# EAGLE design extrudernode (EAGLE 6.4)
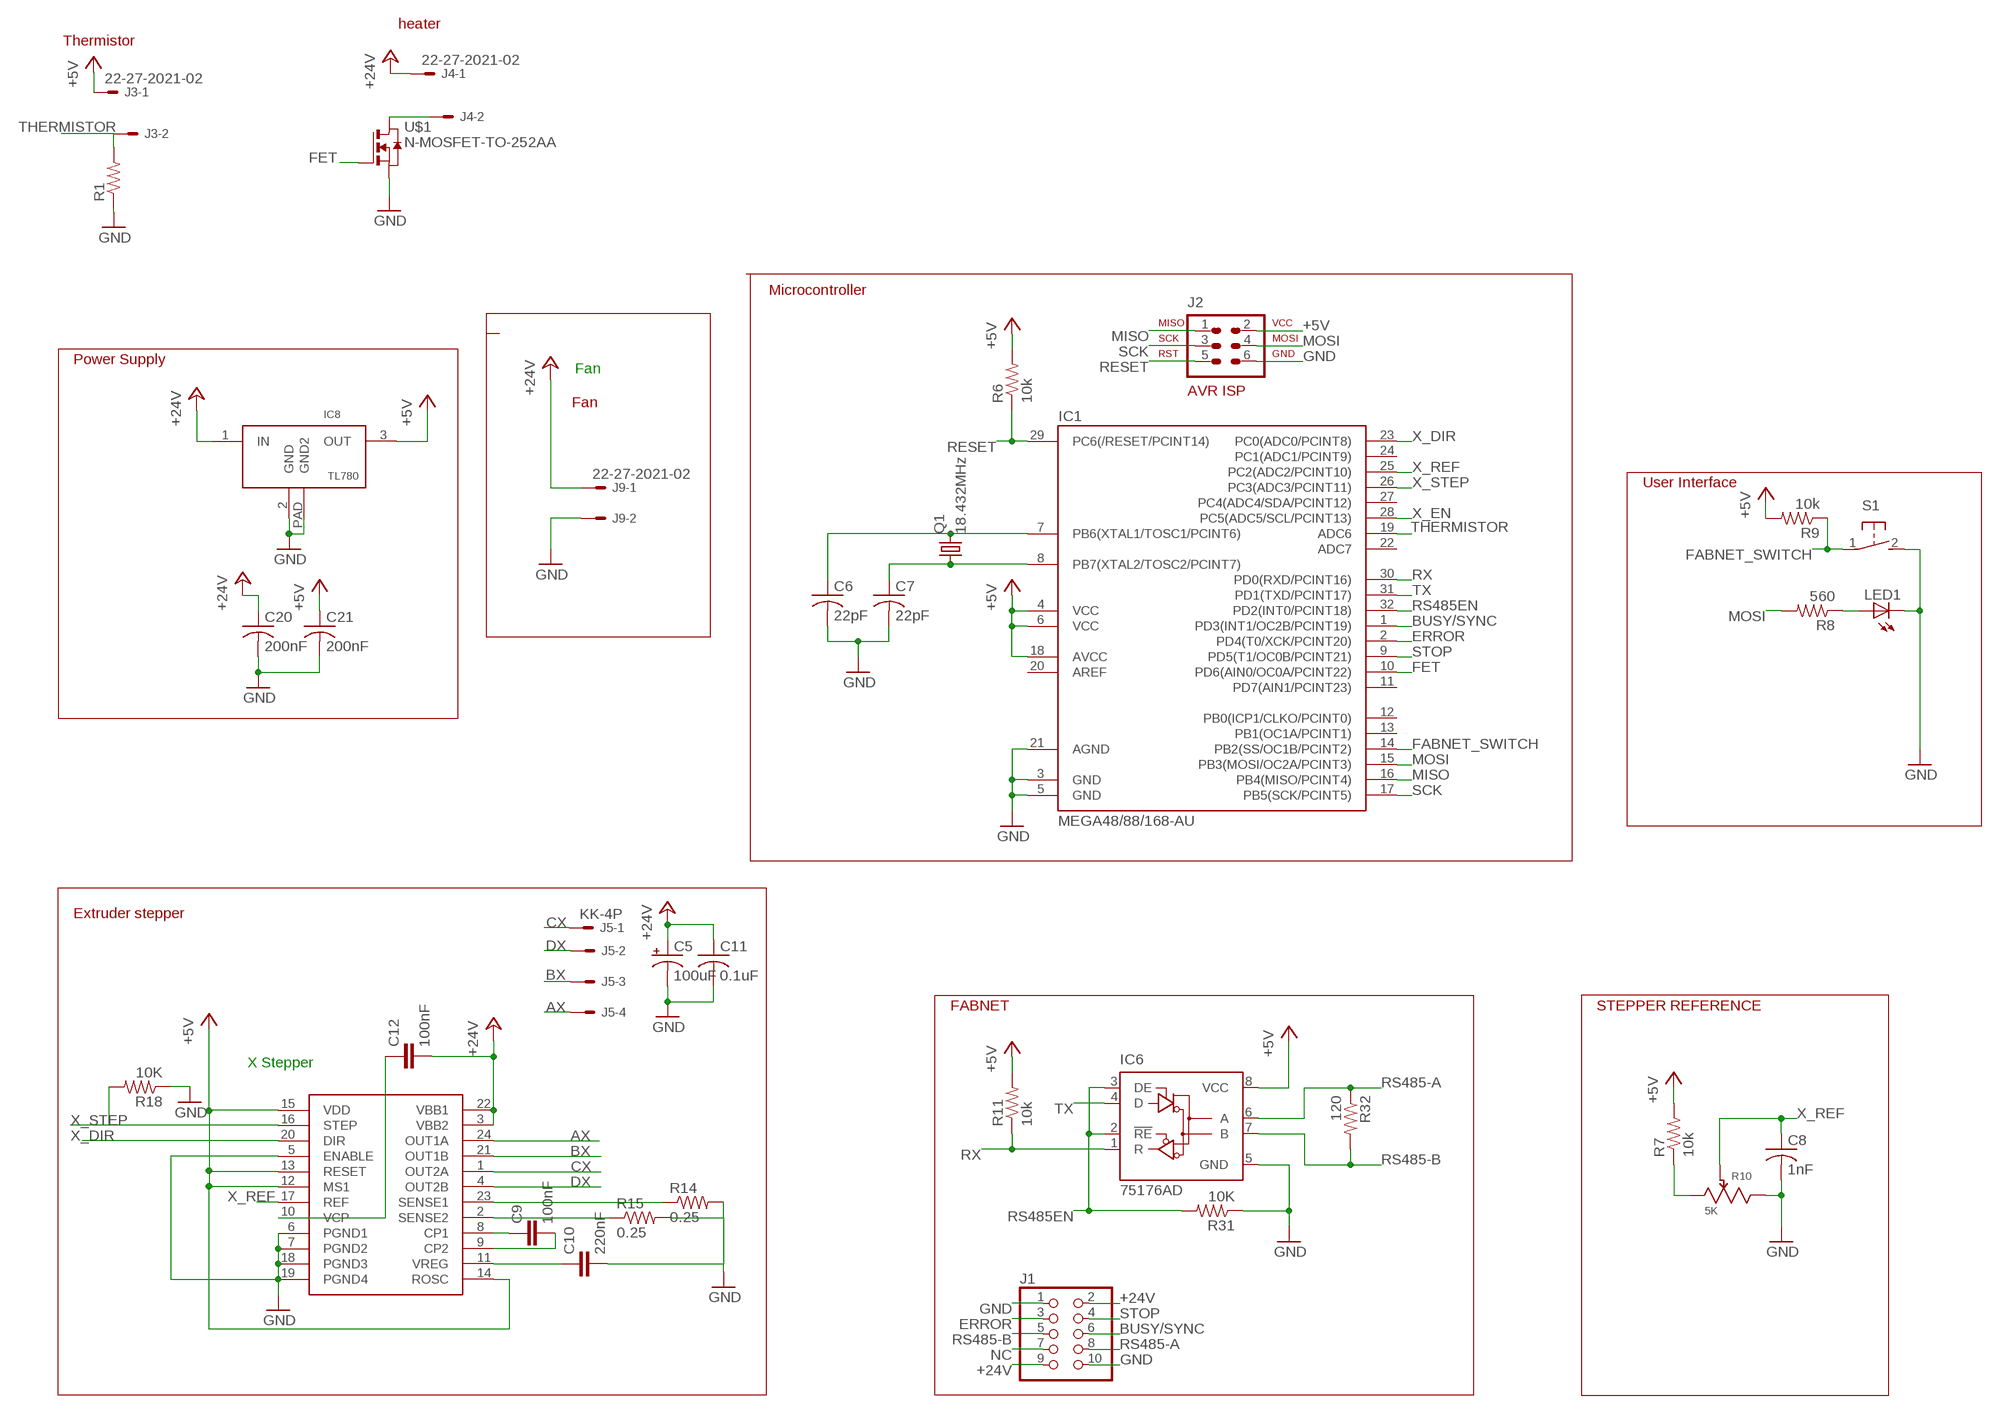
[diagram p0: schematic, sheet 1]

## Parts
C5  100uF  CPOL-USD  [PANASONIC_D]
C6  22pF  C-USC0805  [C0805@1]
C7  22pF  C-USC0805  [C0805@1]
C8  1nF  C-USC0805  [C0805@1]
C9  100nF  C-EUC1206  [C1206]
C10  220nF  C-EUC1206  [C1206]
C11  0.1uF  C-USC0805  [C0805@1]
C12  100nF  C-EUC1206  [C1206]
C20  200nF  C-USC0805  [C0805@1]
C21  200nF  C-USC0805  [C0805@1]
DRIVER3  A3982  A3982SOIC24  [SO24W]
IC1  MEGA48/88/168-AU  [TQFP32-08]
IC6  75176AD  [D_R-PDSO-G8]
IC8  TL780_VREG  [D2PAK-3]
J1  PINHD-2X5  [2X05]
J2  AVR-ISP-6VERT  [AVR-ISP-6]
J3  22-27-2021-02  [6410-02]
J4  22-27-2021-02  [6410-02]
J5  KK-4P  22-05-7048-04  [7395-04]
J9  22-27-2021-02  [6410-02]
LED1  LEDCHIPLED_0603  [CHIPLED_0603]
Q1  18.432MHz  CRYSTALHC49UP  [HC49UP]
R1  RESISTOR1206  [1206]
R6  10k  R-US_R0805  [R0805]
R7  10k  R-US_R0805  [R0805]
R8  560  R-US_R0805  [R0805]
R9  10k  R-US_R0805  [R0805]
R10  5K  BOURN_POT  [BOURN_TRIM]
R11  10k  R-US_R0805  [R0805]
R14  0.25  R-US_R2512  [R2512]
R15  0.25  R-US_R2512  [R2512]
R18  10K  R-US_R1206  [R1206]
R31  10K  R-US_R0805  [R0805]
R32  120  R-US_R0805  [R0805]
S1  31-XX  [B3F-31XX]
U$1  N-MOSFET-TO-252AA  [TO-252AA]

## Nets
+5V: C21.1 DRIVER3.12(MS1) DRIVER3.13(RESET) DRIVER3.14(ROSC) DRIVER3.15(VDD) IC1.4(VCC) IC1.6(VCC) IC1.18(AVCC) IC6.8(VCC) IC8.3(OUT) J2.2 J3.1 R6.2 R7.2 R9.2 R11.2
+24V: C5.+ C11.1 C12.2 C20.1 DRIVER3.3(VBB2) DRIVER3.22(VBB1) IC8.1(IN) J1.2 J1.9 J4.1 J9.1
AX [power]: DRIVER3.24(OUT1A) J5.4
BUSY/SYNC: IC1.1(PD3(INT1/OC2B/PCINT19)) J1.6
BX [power]: DRIVER3.21(OUT1B) J5.3
CX [power]: DRIVER3.1(OUT2A) J5.1
DX [power]: DRIVER3.4(OUT2B) J5.2
ERROR: IC1.2(PD4(T0/XCK/PCINT20)) J1.3
FABNET_SWITCH: IC1.14(PB2(SS/OC1B/PCINT2)) R9.1 S1.1(P)
FET: IC1.10(PD6(AIN0/OC0A/PCINT22)) U$1.GATE(G)
GND: C5.- C6.2 C7.2 C8.2 C10.2 C11.2 C20.2 C21.2 DRIVER3.5(ENABLE) DRIVER3.6(PGND1) DRIVER3.7(PGND2) DRIVER3.18(PGND3) DRIVER3.19(PGND4) IC1.3(GND) IC1.5(GND) IC1.21(AGND) IC6.5(GND) IC8.2(GND) IC8.PAD(GND2) J1.1 J1.10 J2.6 J9.2 LED1.C R1.1 R10.3 R14.2 R15.2 R18.1 R31.1 S1.2(S) U$1.SOURCE(S)
MISO: IC1.16(PB4(MISO/PCINT4)) J2.1
MOSI: IC1.15(PB3(MOSI/OC2A/PCINT3)) J2.4 R8.2
N2354: R7.1 R10.1
N$1: C6.1 IC1.7(PB6(XTAL1/TOSC1/PCINT6)) Q1.2
N$2: C7.1 IC1.8(PB7(XTAL2/TOSC2/PCINT7)) Q1.1
N$5: LED1.A R8.1
N$8: J4.2 U$1.DRAIN(D)
N$23 [power]: DRIVER3.23(SENSE1) R14.1
N$24 [power]: DRIVER3.2(SENSE2) R15.1
N$25: C9.1 DRIVER3.8(CP1)
N$26: C9.2 DRIVER3.9(CP2)
N$27: C10.1 DRIVER3.11(VREG)
N$28: C12.1 DRIVER3.10(VCP)
NC: J1.7
RESET: IC1.29(PC6(/RESET/PCINT14)) J2.5 R6.1
RS485-A: IC6.6(A) J1.8 R32.1
RS485-B: IC6.7(B) J1.5 R32.2
RS485EN: IC1.32(PD2(INT0/PCINT18)) IC6.2(!RE) IC6.3(DE) R31.2
RX: IC1.30(PD0(RXD/PCINT16)) IC6.1(R) R11.1
SCK: IC1.17(PB5(SCK/PCINT5)) J2.3
STOP: IC1.9(PD5(T1/OC0B/PCINT21)) J1.4
THERMISTOR: IC1.19(ADC6) J3.2 R1.2
TX: IC1.31(PD1(TXD/PCINT17)) IC6.4(D)
X_DIR: DRIVER3.20(DIR) IC1.23(PC0(ADC0/PCINT8))
X_EN: IC1.28(PC5(ADC5/SCL/PCINT13))
X_REF: C8.1 DRIVER3.17(REF) IC1.25(PC2(ADC2/PCINT10)) R10.2
X_STEP: DRIVER3.16(STEP) IC1.26(PC3(ADC3/PCINT11)) R18.2
Unconnected: IC1.11(PD7(AIN1/PCINT23)) IC1.12(PB0(ICP1/CLKO/PCINT0)) IC1.13(PB1(OC1A/PCINT1)) IC1.20(AREF) IC1.22(ADC7) IC1.24(PC1(ADC1/PCINT9)) IC1.27(PC4(ADC4/SDA/PCINT12))

## Notes on the sheet
- heater
- Thermistor
- Microcontroller
- Power Supply
- Fan
- Fan
- User Interface
- Extruder stepper
- FABNET | STEPPER REFERENCE
- X Stepper

## Library data of the parts
C5 = rcl:CPOL-US: POLARIZED CAPACITOR, American symbol
C6-C8 C11 C20 C21 = rcl:C-US: CAPACITOR, American symbol
C9 C10 C12 = rcl:C-EU: CAPACITOR, European symbol
DRIVER3 = reprap:A3982
IC1 = avr-7:MEGA48/88/168
IC6 = 751xx:75176A: DIFFERENTIAL BUS TRANSCEIVER Source: http://focus.ti.com/lit/ds/symlink/sn75176a.pdf
IC8 = MtMM:TL780_VREG
J1 = pinhead:PINHD-2X5: PIN HEADER
J2 = avr-7:AVR-ISP-6: AVR ISP-6 Serial Programming Header
J3 J4 J9 = con-molex:22-?-02: CONNECTOR wire to board 2.54 mm (.1 inch) pitch header; OC_FARNELL: unknown; OC_NEWARK: unknown
J5 = con-molex:22-?-04: CONNECTOR wire to board 2.54 mm (.1 inch) pitch header; OC_FARNELL: unknown; OC_NEWARK: unknown
LED1 = led:LED: LED OSRAM: - CHIPLED LG R971, LG N971, LY N971, LG Q971, LY Q971, LO R971, LY R971 LH N974, LH R974 LS Q976, LO Q976, LY Q976 LO Q996 - Hyper CHIPLED LW Q18S LB Q993, LB Q99A, LB R99A - SideLED LS A670, LO A670, LY A670, LG A670, LP A670 LB A673, LV A673, LT A673, LW A673 LH A674 LY A675 LS A676, LA A676, LO A676, LY A676, LW A676 LS A679, LY A679, LG A679 - Hyper Micro SIDELED® LS Y876, LA Y876, LO Y876, LY Y876 LT Y87S - SmartLED LW L88C, LW L88S LB L89C, LB L89S, LG L890 LS L89K, LO L89K, LY L89K LS L896, LA L896, LO L896, LY L896 - TOPLED LS T670, LO T670, LY T670, LG T670, LP T670 LSG T670, LSP T670, LSY T670, LOP T670, LYG T670 LG T671, LOG T671, LSG T671 LB T673, LV T673, LT T673, LW T673 LH T674 LS T676, LA T676, LO T676, LY T676, LB T676, LH T676, LSB T676, LW T676 LB T67C, LV T67C, LT T67C, LS T67K, LO T67K, LY T67K, LW E67C LS E67B, LA E67B, LO E67B, LY E67B, LB E67C, LV E67C, LT E67C LW T67C LS T679, LY T679, LG T679 LS T770, LO T770, LY T770, LG T770, LP T770 LB T773, LV T773, LT T773, LW T773 LH T774 LS E675, LA E675, LY E675, LS T675 LS T776, LA T776, LO T776, LY T776, LB T776 LHGB T686 LT T68C, LB T68C - Hyper Mini TOPLED® LB M676 - Mini TOPLED Santana® LG M470 LS M47K, LO M47K, LY M47K Source: http://www.osram.convergy.de LUXEON: - LUMILED® LXK2-PW12-R00, LXK2-PW12-S00, LXK2-PW14-U00, LXK2-PW14-V00 LXK2-PM12-R00, LXK2-PM12-S00, LXK2-PM14-U00 LXK2-PE12-Q00, LXK2-PE12-R00, LXK2-PE12-S00, LXK2-PE14-T00, LXK2-PE14-U00 LXK2-PB12-K00, LXK2-PB12-L00, LXK2-PB12-M00, LXK2-PB14-N00, LXK2-PB14-P00, LXK2-PB14-Q00 LXK2-PR12-L00, LXK2-PR12-M00, LXK2-PR14-Q00, LXK2-PR14-R00 LXK2-PD12-Q00, LXK2-PD12-R00, LXK2-PD12-S00 LXK2-PH12-R00, LXK2-PH12-S00 LXK2-PL12-P00, LXK2-PL12-Q00, LXK2-PL12-R00 Source: www.luxeon.com KINGBRIGHT: KA-3528ASYC Source: www.kingbright.com
Q1 = crystal:CRYSTAL: CRYSTAL; OC_FARNELL: unknown; OC_NEWARK: unknown
R1 = ng:RESISTOR
R6-R9 R11 R14 R15 R31 R32 = rcl:R-US_: RESISTOR, American symbol
R10 = unitoffab:BOURN_POT
R18 = resistor:R-US_: RESISTOR, American symbol
S1 = switch-omron:31-XX: OMRON SWITCH; MPN: B3F-3100; OC_FARNELL: 959704; OC_NEWARK: 36M3582
U$1 = nmosfet:N-MOSFET-TO-252AA

## Net classes
1 power: width 0.305 mm, clearance 0.203 mm

## Board
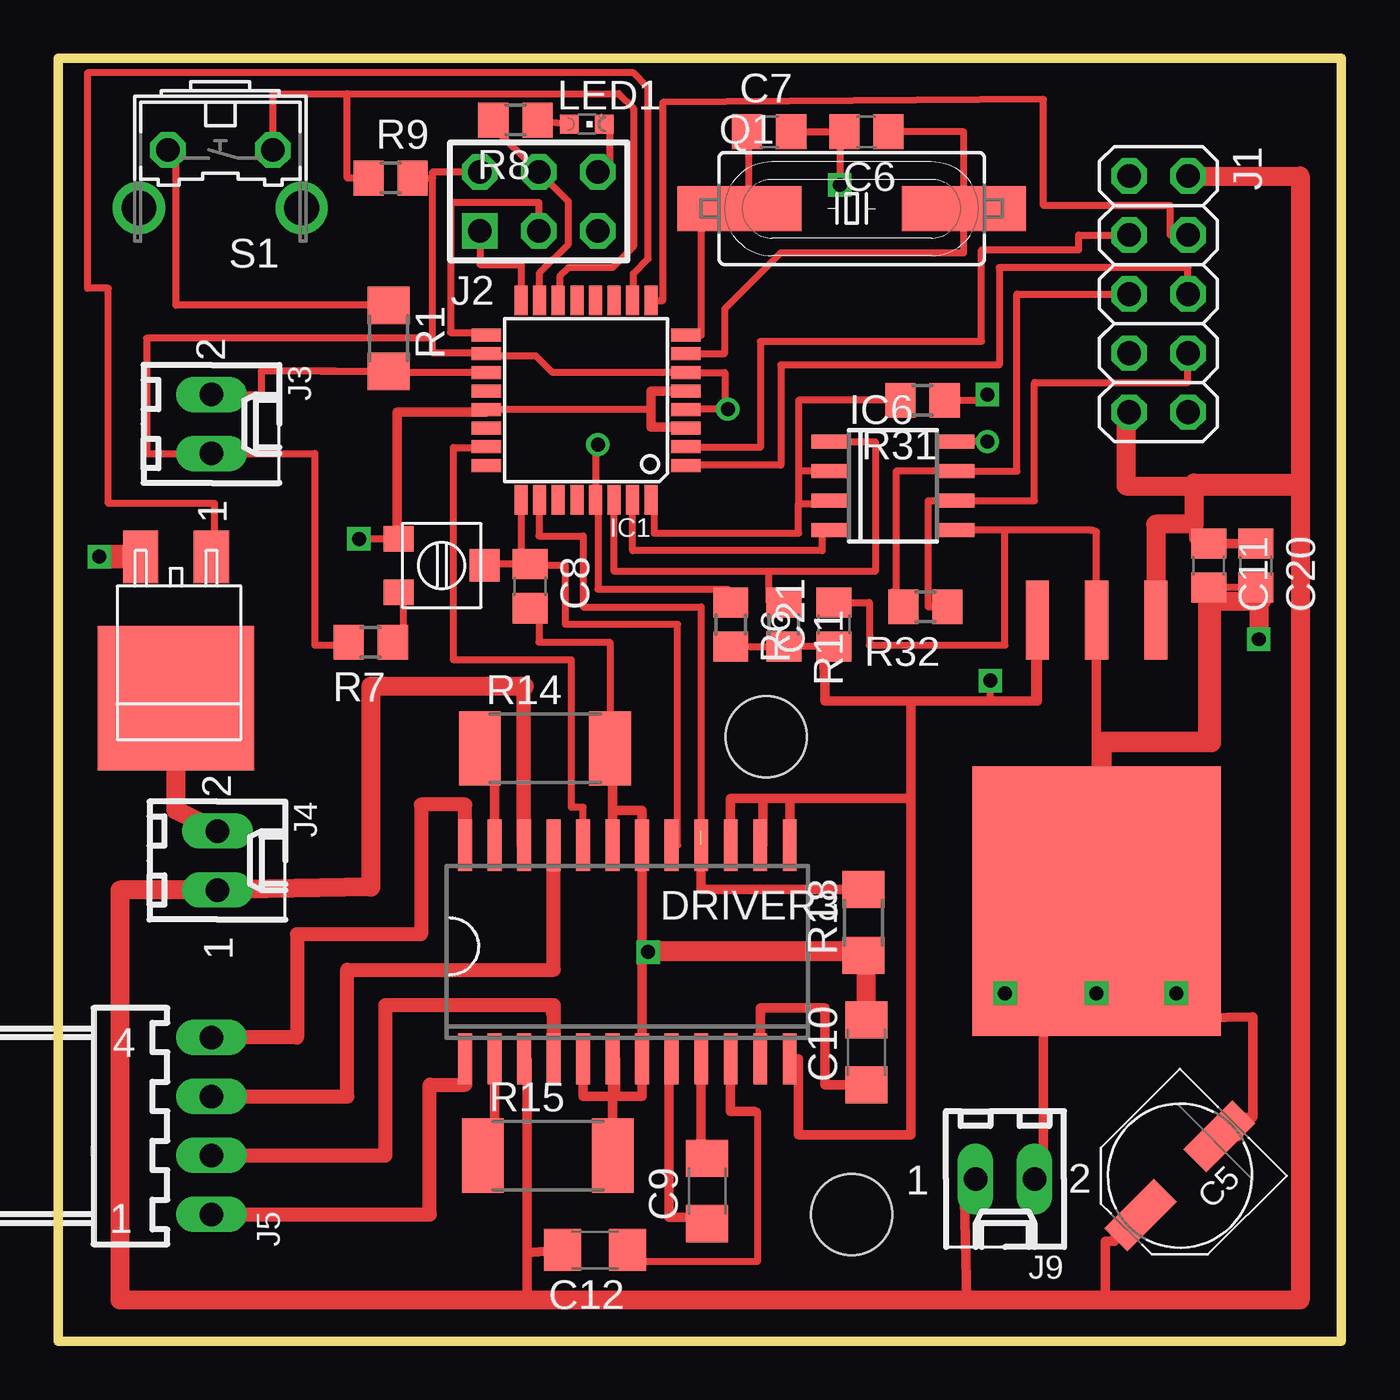
[diagram p1: board, top side]
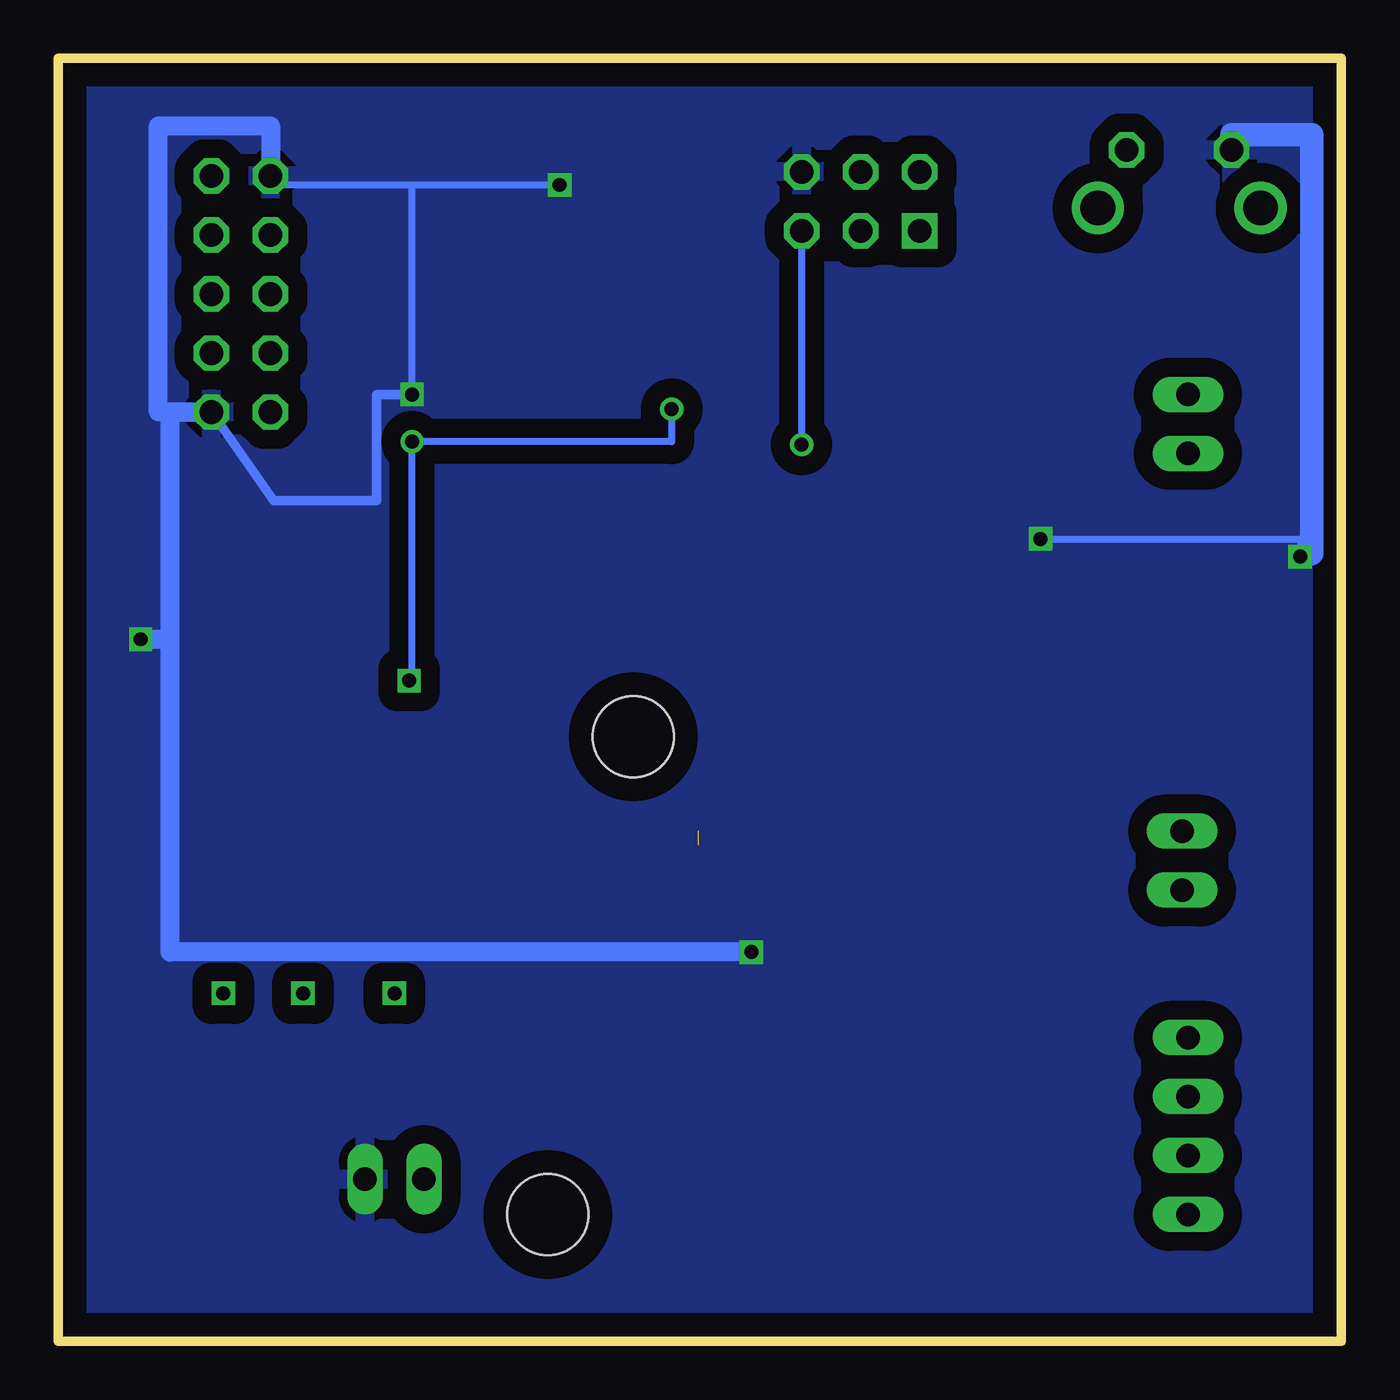
[diagram p2: board, bottom side, seen from below]

Size 55.24 x 55.24 mm. Coordinates in mm from the lower left corner, seen from the top.
Outline: 0,0 0,55.24 55.24,55.24 55.24,0 0,0
Copper layers (1*16): Top 0.035mm / dielectric 1.5mm / Bottom 0.035mm
Design rules "default": minimum track width 10mil, minimum drill 15mil, track to track 6mil, track to pad 6mil, pad to pad 6mil, via to via 6mil, smd to smd 0mil, copper to edge 40mil, drill to drill 8mil, minimum pad ring 10mil, minimum via ring 8mil, stop-mask expansion 4mil, vias tented up to drill 0mil, thermal gap 14mil
Holes 3.51 mm at 30.48,26.04 34.16,5.46

### Footprints (pad centres in the part's own frame; a part is rotated, then mirrored left to right if it is on the bottom)
PANASONIC_D = smd 3 x 1.4: + 2.4,0; - -2.4,0
C0805@1 = smd 1.3 x 1.5: 1 -0.95,0; 2 0.95,0
C1206 = smd 1.6 x 1.8: 1 -1.4,0; 2 1.4,0
SO24W = smd 0.6 x 2.2: 1 -6.985,-4.6; 2 -5.715,-4.6; 3 -4.445,-4.6; 4 -3.175,-4.6; 5 -1.905,-4.6; 6 -0.635,-4.6; 7 0.635,-4.6; 8 1.905,-4.6; 9 3.175,-4.6; 10 4.445,-4.6; 11 5.715,-4.6; 12 6.985,-4.6; 13 6.985,4.6; 14 5.715,4.6; 15 4.445,4.6; 16 3.175,4.6; 17 1.905,4.6; 18 0.635,4.6; 19 -0.635,4.6; 20 -1.905,4.6; 21 -3.175,4.6; 22 -4.445,4.6; 23 -5.715,4.6; 24 -6.985,4.6
TQFP32-08 = smd 1.27 x 0.559: 1 -4.293,2.8; 2 -4.293,2; 3 -4.293,1.2; 4 -4.293,0.4; 5 -4.293,-0.4; 6 -4.293,-1.2; 7 -4.293,-2; 8 -4.293,-2.8; 17 4.293,-2.8; 18 4.293,-2; 19 4.293,-1.2; 20 4.293,-0.4; 21 4.293,0.4; 22 4.293,1.2; 23 4.293,2; 24 4.293,2.8 | smd 0.559 x 1.27: 9 -2.8,-4.293; 10 -2,-4.293; 11 -1.2,-4.293; 12 -0.4,-4.293; 13 0.4,-4.293; 14 1.2,-4.293; 15 2,-4.293; 16 2.8,-4.293; 25 2.8,4.293; 26 2,4.293; 27 1.2,4.293; 28 0.4,4.293; 29 -0.4,4.293; 30 -1.2,4.293; 31 -2,4.293; 32 -2.8,4.293
D_R-PDSO-G8 = smd 0.6 x 1.5: 1 -1.905,-2.75; 2 -0.635,-2.75; 3 0.635,-2.75; 4 1.905,-2.75; 5 1.905,2.75; 6 0.635,2.75; 7 -0.635,2.75; 8 -1.905,2.75
D2PAK-3 = smd 1 x 3.4: 1 -2.55,-10.6; 2 0,-10.6; 3 2.55,-10.6 | smd 10.7 x 11.6: PAD 0,1.5
2X05 = drill 1.016 octagon: 1 -5.08,-1.27; 2 -5.08,1.27; 3 -2.54,-1.27; 4 -2.54,1.27; 5 0,-1.27; 6 0,1.27; 7 2.54,-1.27; 8 2.54,1.27; 9 5.08,-1.27; 10 5.08,1.27
AVR-ISP-6 = drill 1.016 square: 1 -2.54,-1.27 | drill 1.016 octagon: 2 -2.54,1.27; 3 0,-1.27; 4 0,1.27; 5 2.54,-1.27; 6 2.54,1.27
6410-02 = drill 1.016 long: 1 1.27,0; 2 -1.27,0
7395-04 = drill 1.016 long: 1 3.81,0; 2 1.27,0; 3 -1.27,0; 4 -3.81,0
CHIPLED_0603 = smd 0.8 x 0.8: A 0,-0.75; C 0,0.75
HC49UP = smd 5.334 x 1.93: 1 -4.826,0; 2 4.826,0
1206 = smd 1.6 x 1.803: 1 -1.422,0; 2 1.422,0
R0805 = smd 1.3 x 1.5: 1 -0.95,0; 2 0.95,0
BOURN_TRIM = smd 1.1 x 1.3: 1 1.15,-1.85; 3 -1.15,-1.85 | smd 1.4 x 1.3: 2 0,1.85
R2512 = smd 1.8 x 3.2: 1 -2.8,0; 2 2.8,0
R1206 = smd 1.6 x 1.803: 1 -1.422,0; 2 1.422,0
B3F-31XX = drill 1.016 octagon: 1 -2.261,-1.245; 2 2.261,-1.245 | drill 1.499 pad 2.159: 3 -3.505,1.245; 4 3.505,1.245
TO-252AA = smd 6.731 x 6.223: DRAIN 3.302,3.048 | smd 1.524 x 2.261: GATE 1.778,-3.048; SOURCE 4.826,-3.048

### Placement (x,y rotation side)
C5  48.29,7.13 225 top
C6  34.8,52.07 180 top
C7  30.61,52.07 0 top
C8  20.32,32.51 270 top
C9  27.94,6.48 90 top
C10  34.8,12.45 90 top
C11  49.53,33.4 270 top
C12  23.11,3.94 180 top
C20  51.56,33.4 270 top
C21  33.4,30.86 90 top
DRIVER3  24.51,16.76 0 top
IC1  22.73,40.51 180 top
IC6  35.94,36.83 270 top
IC8  44.7,20.45 180 top
J1  47.37,45.09 270 top
J2  20.69,49.07 0 top
J3  6.6,39.5 270 top
J4  6.86,20.7 270 top
J5  6.6,9.27 270 top
J9  40.77,6.99 180 top
LED1  22.75,52.4 270 top
Q1  34.16,48.77 0 top
R1  14.22,43.18 270 top
R6  28.96,30.86 270 top
R7  13.46,30.1 180 top
R8  19.68,52.58 180 top
R9  14.31,50.08 0 top
R10  16.51,33.4 270 top
R11  31.24,30.86 270 top
R14  20.95,25.53 0 top
R15  21.08,8 0 top
R18  34.67,18.03 90 top
R31  37.21,40.51 180 top
R32  37.34,31.62 180 top
S1  6.99,50.04 180 top
U$1  8.38,30.73 180 top

### Tracks (layer width: path | path; a pad name or v marks a point on that pad's centre or on a via)
+5V  (via drill 0.6)
  Top 0.305: C21.1 R11.2 R6.2 | 28.7,40.13 28.7,41.71 IC1.6 21.28,41.71 20.57,42.42 18.54,42.42 IC1.18 18.41,42.55 16.13,42.55 16.13,43.18 | 28.7,40.13 27.03,40.13 IC1.4 | 33.02,27.56 32.89,29.84 | J2.2 16.13,50.34 16.13,50.08 | 16.13,43.18 16.13,50.08 | 28.7,40.13 v28.83,40.13 | v40.01,38.73 IC6.8 | IC8.3 42.04,29.9 42.04,27.56 | 40.01,27.56 40.13,27.56 v40.13,28.45 | R9.2 16.13,50.08 | R7.2 12.51,29.97 11.05,29.97 11.05,38.23 J3.1 3.81,38.23 3.81,43.18 16.13,43.18
  Top 0.406: DRIVER3.13 31.5,23.37 | 31.5,23.37 30.35,23.37 | 30.35,23.37 28.96,23.37 DRIVER3.15 | DRIVER3.14 30.35,21.36 30.35,23.37 | DRIVER3.12 31.88,12.16 31.88,8.89 36.7,8.89 36.7,23.37 | 36.7,23.37 36.7,27.56 | C21.1 33.27,29.72 33.02,29.46 33.02,27.56 36.7,27.56 | 36.7,27.56 40.01,27.56 42.04,27.56 42.15,27.56 IC8.3 | 31.5,23.37 36.7,23.37
  Bottom 0.305: v28.83,40.13 28.83,38.73 v40.01,38.73 40.01,28.45 v40.13,28.45
+24V
  Top 0.305: IC8.1 47.12,31.44 47.12,35.18 49.02,35.18 48.9,35.31 48.9,36.96
  Top 0.406: 20.19,3.81 20.19,12.16 DRIVER3.3 | 20.19,3.81 C12.2 | C20.1 C11.1 49.4,34.35 49.4,34.54 48.9,34.54 48.9,36.07 | 20.19,3.81 20.19,1.78 | DRIVER3.22 19.94,21.36 19.94,28.19 | C5.+ 45.97,5.44 45.97,4.45 45.47,4.45 45.47,4.32 45.09,4.32 45.09,1.78 | J9.1 38.99,6.99 39.12,1.78
  Top 0.61: DRIVER3.22 20.07,28.19
  Top 0.813: J1.2 53.47,50.16 53.47,36.96 | 53.47,36.83 48.9,36.96 | 48.9,36.96 48.9,36.07 48.9,35.18 47.25,35.18 IC8.1 | J1.9 45.97,40.01 45.97,36.83 53.47,36.83 | 48.9,36.96 53.47,36.96 | 53.47,36.96 53.47,36.83 | 53.47,36.83 53.47,1.78 45.09,1.78 39.12,1.78 20.19,1.78 2.67,1.78 2.67,19.43 J4.1 13.46,19.56 13.46,28.19 20.07,28.19
AX
  Top 0.61: DRIVER3.24 17.53,23.11 15.62,23.11 15.62,17.53 10.29,17.53 10.29,13.08 J5.4
BUSY/SYNC
  Top 0.305: J1.6 48.64,46.23 40.51,46.23 40.51,42.04 31.11,42.04 31.11,37.72 IC1.1
BX
  Top 0.406: 21.34,17.91 DRIVER3.21
  Top 0.61: J5.3 12.45,10.54 12.45,16 21.34,16 DRIVER3.21
CX
  Top 0.61: J5.1 16,5.46 16,11.05 17.53,11.05 DRIVER3.1
DX
  Top 0.406: 21.21,14.1 21.34,14.48
  Top 0.61: J5.2 14.1,8 14.1,14.48 21.34,14.48 DRIVER3.4
ERROR
  Top 0.305: IC1.2 27.03,38.48 30.23,38.48 30.23,43.05 39.75,43.05 39.75,46.99 43.94,46.99 43.94,47.62 J1.3
FABNET_SWITCH
  Top 0.305: 12.45,53.72 9.25,53.72 S1.1 | 12.45,53.72 24.13,53.72 24.77,53.09 24.77,47.12 23.88,46.23 21.97,46.23 21.59,45.85 21.59,44.86 IC1.14 | R9.1 12.45,50.08 12.45,53.72
FET
  Top 0.305: IC1.10 24.77,44.81 24.77,45.97 25.4,46.61 25.4,53.98 24.77,54.61 1.27,54.61 1.27,45.34 2.16,45.34 2.16,36.07 6.73,36.07 6.73,33.78 U$1.GATE
GND  (via drill 0.6)
  Top 0.305: C20.2 C11.2 | C7.2 C6.2 33.66,52.07 v33.66,49.78 | IC1.21 18.65,40.11 19.05,40.13 25.53,40.13 | C8.2 20.7,31.56 20.7,30.1 23.75,30.1 R14.2 | 40.77,34.92 IC6.5 | IC8.2 44.7,34.86 44.45,34.92 40.77,34.92 | C21.2 34.92,31.81 34.92,29.97 40.77,29.97 40.77,34.92 | LED1.C 23.75,52.4 23.75,50.29 23.23,50.29 J2.6 | R31.1 40.01,40.51 v40.01,40.77 | R1.1 5.08,44.6 5.08,51.44 4.85,51.44 S1.2 | 14.61,40.01 14.61,34.54 v12.95,34.54
  Top 0.406: R14.2 23.88,25.91 23.88,22.86 | DRIVER3.19 23.88,22.86 | 23.88,22.86 25.15,22.86 DRIVER3.18 25.15,17.02 | 24,10.54 22.61,10.54 DRIVER3.5 | 24,10.54 24,12.16 DRIVER3.6 23.88,9.02 24.14,9.02 R15.2 | 24,10.54 25.15,10.54 DRIVER3.7 25.15,17.02 | R18.1 34.8,16.61 C10.2 34.67,13.85 34.67,17.02 25.15,17.02 | IC1.5 25.53,40.91 25.53,40.13 25.53,39.37 27.03,39.37 IC1.3 | 44.7,26.04 IC8.PAD 44.7,17.4 44.45,17.4 44.45,14.1 | 44.7,26.04 IC8.2 | IC1.21 18.44,40.01 14.61,40.01 14.61,34.55 R10.3 | C11.2 49.28,32.45 49.28,26.04 44.7,26.04 | C5.- 50.8,8.83 50.8,9.65 51.44,9.65 51.44,13.97 44.58,13.84 44.45,14.1 | J9.2 42.42,6.99 42.42,14.1 44.45,14.1
  Top 0.813: 42.42,14.1 48.64,14.1 48.64,22.61 44.96,22.61 44.96,25.78 49.66,25.78 49.66,31.88 51.82,31.88 51.82,32.26 51.69,32.26 v51.69,30.23 | C10.2 34.8,16.76 v25.4,16.76
  Top 1.016: U$1.SOURCE v1.78,33.78
  Bottom 0.305: v33.66,49.78 40.01,49.78 | 40.01,49.78 46.1,49.78 J1.1 | 40.01,40.89 40.01,49.78 | v12.95,34.54 1.78,34.54 v1.78,33.78
  Bottom 0.406: J1.10 45.97,36.2 41.53,36.2 41.53,40.77 v40.01,40.77 40.01,40.89
  Bottom 0.813: J1.1 46.1,52.32 50.93,52.32 50.93,40.01 J1.10 50.42,40.01 50.42,30.23 | v51.69,30.23 50.42,30.23 | v25.4,16.76 50.42,16.76 50.42,30.23
  Bottom 1.016: v1.78,33.78 1.27,33.91 1.27,51.94 4.72,51.94 S1.2
  pour Bottom (isolate 0.813): 0.38,54.74 54.61,54.74 54.48,0.51 0.64,0.51
MISO
  Top 0.305: J2.1 18.16,47.8 18.16,46.35 19.93,46.35 IC1.16
MOSI
  Top 0.305: 20.7,44.84 IC1.15 20.73,46.01 21.97,47.24 21.97,49.07 J2.4 19.3,51.69 18.8,52.2 R8.2
N2354
  Top 0.305: 14.66,32.32 R10.1 | R10.1 | R10.1 14.86,32.25 14.86,29.84 14.41,29.84 R7.1
N$1
  Top 0.305: IC1.7 28.67,42.51 28.7,42.55 28.7,44.45 31.11,46.86 38.99,46.86 Q1.2 38.99,52.07 C6.1
N$2
  Top 0.305: Q1.1 28.32,48.64 | 28.32,48.64 27.69,48.01 27.69,43.31 IC1.8 | C7.1 29.72,52.07 29.72,49.02 28.32,49.02 | 27.81,49.02 28.32,49.02 | 28.32,49.02 28.32,48.64
N$3  (via drill 0.6)
  other vias: 40.77,14.99
N$4  (via drill 0.6)
  other vias: 44.7,14.99
N$5
  Top 0.305: R8.1 LED1.A
N$6  (via drill 0.6)
  other vias: 48.13,14.99
N$8
  Top 0.813: J4.2 5.08,22.86 U$1.DRAIN
N$23
  Top 0.406: R14.1 18.8,25.91 DRIVER3.23
N$24
  Top 0.406: DRIVER3.2 18.8,9.4 18.54,9.4 R15.1
N$25
  Top 0.406: DRIVER3.8 26.29,12.16 26.29,5.33 28.45,5.33 C9.1
N$26
  Top 0.406: C9.2 27.69,8.51 DRIVER3.9
N$27
  Top 0.406: C10.1 33.02,11.05 33.02,14.35 30.23,14.35 DRIVER3.11
N$28
  Top 0.305: 29.97,9.91 30.1,9.91 30.1,3.43 24.51,3.43 C12.1
  Top 0.406: 29.97,9.91 28.96,9.91 DRIVER3.10
RESET  (via drill 0.6)
  Top 0.305: R6.1 28.83,32.38 23.24,32.38 23.24,36.24 23.11,36.24 IC1.29 23.13,38.61 v23.24,38.61
  Bottom 0.305: J2.5 v23.24,38.61
RS485-A
  Top 0.305: R32.1 37.47,31.62 37.47,36.2 IC6.6 42.04,36.2 42.04,41.27 48.64,41.27 J1.8
RS485-B
  Top 0.305: R32.2 35.88,32.26 36.07,32.26 36.07,37.47 IC6.7 39.12,37.47 | 39.12,37.47 39.12,37.34 | 39.12,37.47 41.27,37.47 41.27,45.09 J1.5
RS485EN
  Top 0.305: IC1.32 25.65,36.22 25.65,34.8 31.88,34.8 31.88,36.07 | 31.88,36.07 33.57,36.07 IC6.3 | IC6.2 31.88,37.47 | 31.88,37.47 31.88,36.07 | R31.2 31.88,40.51 31.88,37.47
RX
  Top 0.305: R11.1 30.61,31.81 30.61,33.15 | 30.61,33.15 23.93,33.15 IC1.30 | IC6.1 35.18,38.73 35.18,33.15 30.61,33.15
SCK
  Top 0.305: J2.3 20.7,47.8 20.7,49.02 16.89,49.02 16.89,43.43 18.44,43.43 IC1.17
STOP
  Top 0.305: J1.4 47.88,47.62 47.88,48.9 42.42,48.9 42.42,53.47 26.04,53.34 26.04,44.81 IC1.9
THERMISTOR
  Top 0.305: IC1.19 14.22,41.71 R1.2 11.94,41.76 | 11.94,41.76 11.3,41.76 | J3.2 8.76,40.77 8.76,41.78 11.94,41.78 11.94,41.76
TX
  Top 0.305: IC6.4 32.89,34.92 32.89,34.04 24.73,34.04 IC1.31
X_DIR
  Top 0.305: DRIVER3.20 22.61,22.99 22.1,22.99 22.1,29.34 17.02,29.34 17.02,38.48 18.44,38.48 IC1.23
X_REF
  Top 0.305: IC1.25 19.94,33.91 20.32,33.91 C8.1 | C8.1 18.36,33.46 R10.2 | DRIVER3.17 26.67,21.36 26.67,30.86 21.84,30.86 21.84,33.4 20.32,33.4 C8.1
X_STEP  (1 unrouted)
  Top 0.305: IC1.26 20.7,36.22 20.7,34.67 22.61,34.67 22.61,31.62 27.69,31.62 27.69,21.97
  Top 0.406: R18.2 27.69,19.46 DRIVER3.16